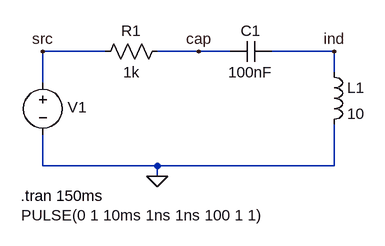
[diagram p0: schematic electronics_lc_tank.asc]
electronics_lc_tank.asc, the LTspice schematic file:
Version 4
SHEET 1 880 680
WIRE 224 64 128 64
WIRE 368 64 304 64
WIRE 416 64 368 64
WIRE 576 64 480 64
WIRE 576 96 576 64
WIRE 128 112 128 64
WIRE 128 240 128 192
WIRE 304 240 128 240
WIRE 576 240 576 176
WIRE 576 240 304 240
WIRE 304 256 304 240
FLAG 304 256 0
FLAG 128 64 src
FLAG 368 64 cap
FLAG 576 64 ind
SYMBOL res 320 48 R90
WINDOW 0 0 56 VBottom 2
WINDOW 3 32 56 VTop 2
SYMATTR InstName R1
SYMATTR Value 1k
SYMBOL voltage 128 96 R0
WINDOW 0 38 54 Left 2
WINDOW 3 -33 220 Left 2
WINDOW 123 0 0 Left 0
WINDOW 39 0 0 Left 0
SYMATTR InstName V1
SYMATTR Value PULSE(0 1 10ms 1ns 1ns 100 1 1)
SYMBOL ind 560 80 R0
SYMATTR InstName L1
SYMATTR Value 10
SYMBOL cap 480 48 R90
WINDOW 0 0 32 VBottom 2
WINDOW 3 32 32 VTop 2
SYMATTR InstName C1
SYMATTR Value 100nF
TEXT 94 286 Left 2 !.tran 150ms

The netlist it stands for:
* electronics_lc_tank.asc
R1 cap src 1k
V1 src 0 PULSE(0 1 10ms 1ns 1ns 100 1 1)
L1 ind 0 10
C1 ind cap 100nF
.tran 150ms
.backanno
.end

* Results of the author's LTspice run, read from the files saved beside the schematic
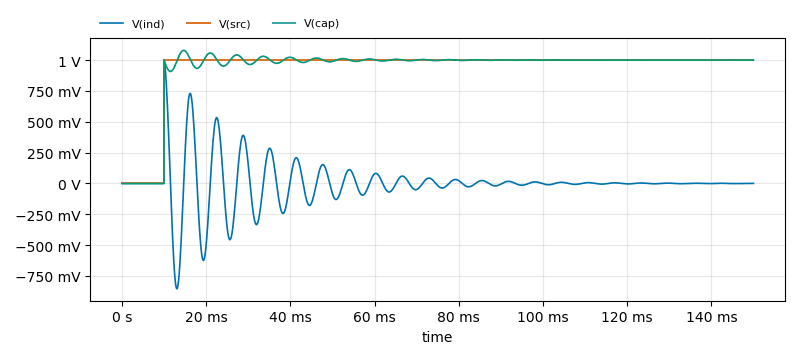
[diagram p1: Transient Analysis of electronics_lc_tank.asc, plotted from the saved traces]
* Transient Analysis, 1 run:
*   V(ind): min -854.2 mV, max 1 V, average 14.76 µV, rms 182.1 mV, last 162.6 µV
*   V(src): min 0 V, max 1 V, average 933.3 mV, rms 966.1 mV, last 1 V
*   V(cap): min 0 V, max 1.079 V, average 932.7 mV, rms 965.6 mV, last 999.9 mV